# EAGLE design drive_board3 (EAGLE 6.1)
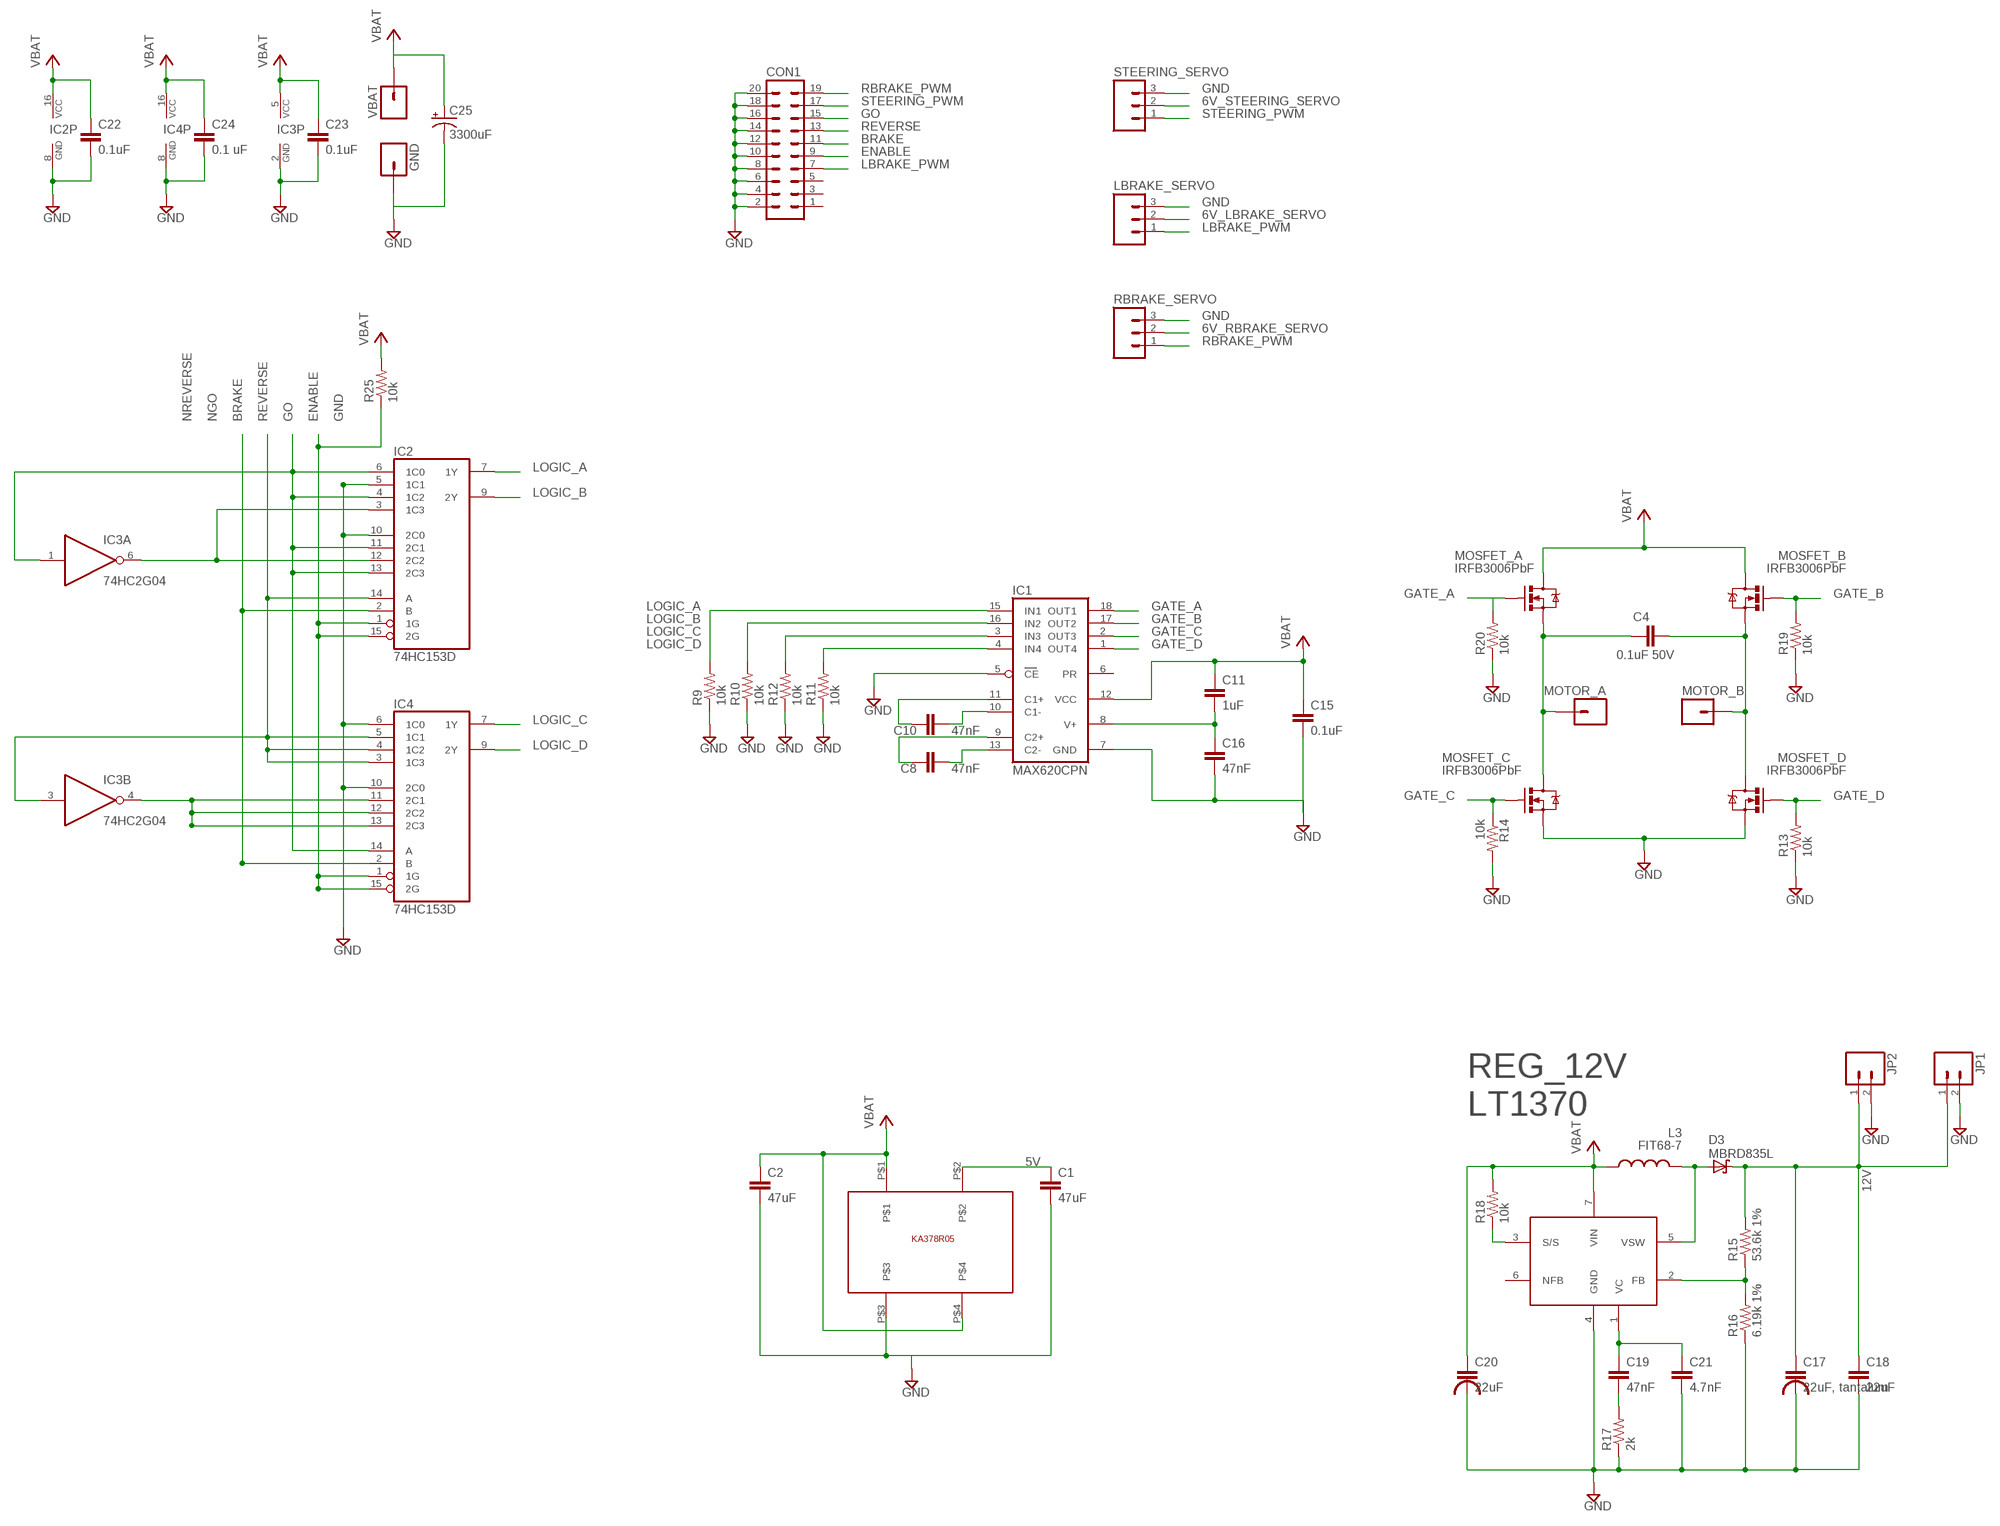
[diagram p0: schematic, sheet 1]

## Parts
C1  47uF  CAP0603-CAP  [0603-CAP]
C2  47uF  CAP0603-CAP  [0603-CAP]
C4  0.1uF 50V  CAP0603-CAP  [0603-CAP]
C8  47nF  CAP0603-CAP  [0603-CAP]
C10  47nF  CAP0603-CAP  [0603-CAP]
C11  1uF  CAP0603-CAP  [0603-CAP]
C15  0.1uF  CAP0603-CAP  [0603-CAP]
C16  47nF  CAP0603-CAP  [0603-CAP]
C17  22uF, tantalum  TPSD226M025R0200  [CAPACITOR_CASE_D]
C18  22uF  CAP0603-CAP  [0603-CAP]
C19  47nF  CAP0603-CAP  [0603-CAP]
C20  22uF  TPSD226M025R0200  [CAPACITOR_CASE_D]
C21  4.7nF  CAP0603-CAP  [0603-CAP]
C22  0.1uF  CAP0603-CAP  [0603-CAP]
C23  0.1uF  CAP0603-CAP  [0603-CAP]
C24  0.1 uF  CAP0603-CAP  [0603-CAP]
C25  3300uF  CAP_POLPTH1  [CPOL-RADIAL-100UF-25V]
CON1  ML20  [ML20]
D3  MBRD835L  [DPACK_1]
GND  GND  PAD_12GAPTH  [PAD_12GA]
IC1  MAX620CPN  [DIL18]
IC2  74HC153D  [SO16]
IC3  74HC2G04  [TSSOP6]
IC4  74HC153D  [SO16]
JP1  M025MM  [SCREWTERMINAL-5MM-2]
JP2  M025MM  [SCREWTERMINAL-5MM-2]
L3  FIT68-7  INDUCTOR  [TOROID_INDUCTOR]
LBRAKE_SERVO  M03POLAR  [MOLEX-1X3]
MOSFET_A  IRFB3006PbF  MOSFET-NCHANNELPTH2  [TO220V]
MOSFET_B  IRFB3006PbF  MOSFET-NCHANNELPTH2  [TO220V]
MOSFET_C  IRFB3006PbF  MOSFET-NCHANNELPTH2  [TO220V]
MOSFET_D  IRFB3006PbF  MOSFET-NCHANNELPTH2  [TO220V]
MOTOR_A  MOTOR A  PAD_12GAPTH  [PAD_12GA]
MOTOR_B  MOTOR B  PAD_12GAPTH  [PAD_12GA]
R9  10k  RESISTOR0603-RES  [0603-RES]
R10  10k  RESISTOR0603-RES  [0603-RES]
R11  10k  RESISTOR0603-RES  [0603-RES]
R12  10k  RESISTOR0603-RES  [0603-RES]
R13  10k  RESISTOR0603-RES  [0603-RES]
R14  10k  RESISTOR0603-RES  [0603-RES]
R15  53.6k 1%  RESISTOR0603-RES  [0603-RES]
R16  6.19k 1%  RESISTOR0603-RES  [0603-RES]
R17  2k  RESISTOR0603-RES  [0603-RES]
R18  10k  RESISTOR0603-RES  [0603-RES]
R19  10k  RESISTOR0603-RES  [0603-RES]
R20  10k  RESISTOR0603-RES  [0603-RES]
R25  10k  RESISTOR0603-RES  [0603-RES]
RBRAKE_SERVO  M03POLAR  [MOLEX-1X3]
REG_12V  LT1370  [TO220-7]
STEERING_SERVO  M03POLAR  [MOLEX-1X3]
U$5  KA378R05  [TO-220-4L]
VBAT  7.2V  PAD_12GAPTH  [PAD_12GA]

## Nets
6V_LBRAKE_SERVO: LBRAKE_SERVO.2
6V_RBRAKE_SERVO: RBRAKE_SERVO.2
6V_STEERING_SERVO: STEERING_SERVO.2
12V: C17.P$1 C18.1 D3.C JP1.1 JP2.1 R15.2
BRAKE: CON1.11 IC2.2(B) IC4.2(B)
ENABLE: CON1.9 IC2.1(1G) IC2.15(2G) IC4.1(1G) IC4.15(2G) R25.1
GATE_A: IC1.18(OUT1) MOSFET_A.1(G) R20.2
GATE_B: IC1.17(OUT2) MOSFET_B.1(G) R19.2
GATE_C: IC1.2(OUT3) MOSFET_C.1(G) R14.1
GATE_D: IC1.1(OUT4) MOSFET_D.1(G) R13.2
GND: C1.2 C2.2 C15.2 C16.2 C17.P$2 C18.2 C20.P$2 C21.2 C22.2 C23.2 C24.2 C25.2(-) CON1.2 CON1.4 CON1.6 CON1.8 CON1.10 CON1.12 CON1.14 CON1.16 CON1.18 CON1.20 GND.1 IC1.5(CE) IC1.7(GND) IC2.5(1C1) IC2.8(GND) IC2.10(2C0) IC3.2(P:GND) IC4.6(1C0) IC4.8(GND) IC4.10(2C0) JP1.2 JP2.2 LBRAKE_SERVO.3 MOSFET_C.3(S) MOSFET_D.3(S) R9.1 R10.1 R11.1 R12.1 R13.1 R14.2 R16.1 R17.1 R19.1 R20.1 RBRAKE_SERVO.3 REG_12V.4(GND) STEERING_SERVO.3 U$5.P$3
GO: CON1.15 IC2.4(1C2) IC2.6(1C0) IC2.11(2C1) IC2.13(2C3) IC3.1(A:I) IC4.14(A)
LBRAKE_PWM: CON1.7 LBRAKE_SERVO.1
LOGIC_A: IC1.15(IN1) IC2.7(1Y) R9.2
LOGIC_B: IC1.16(IN2) IC2.9(2Y) R10.2
LOGIC_C: IC1.3(IN3) IC4.7(1Y) R12.2
LOGIC_D: IC1.4(IN4) IC4.9(2Y) R11.2
MOTOR_A: C4.1 MOSFET_A.3(S) MOSFET_C.2(D) MOTOR_A.1
MOTOR_B: C4.2 MOSFET_B.3(S) MOSFET_D.2(D) MOTOR_B.1
N$1: C10.1 IC1.11(C1+)
N$2: C10.2 IC1.10(C1-)
N$3: C8.2 IC1.13(C2-)
N$4: C8.1 IC1.9(C2+)
N$6: C1.1 U$5.P$2
N$20: D3.B(A) D3.E(A) L3.2 REG_12V.5(VSW)
N$21: R15.1 R16.2 REG_12V.2(FB)
N$22: C19.1 C21.1 REG_12V.1(VC)
N$23: C19.2 R17.2
N$24: R18.1 REG_12V.3(S/S)
NGO: IC2.3(1C3) IC2.12(2C2) IC3.6(A:O)
NREVERSE: IC3.4(B:O) IC4.11(2C1) IC4.12(2C2) IC4.13(2C3)
RBRAKE_PWM: CON1.19 RBRAKE_SERVO.1
REVERSE: CON1.13 IC2.14(A) IC3.3(B:I) IC4.3(1C3) IC4.4(1C2) IC4.5(1C1)
STEERING_PWM: CON1.17 STEERING_SERVO.1
V+: C11.2 C16.1 IC1.8(V+)
VBAT: C11.1 C15.1 C20.P$1 C22.1 C23.1 C24.1 C25.1(+) IC1.12(VCC) IC2.16(VCC) IC3.5(P:VCC) IC4.16(VCC) L3.1 MOSFET_A.2(D) MOSFET_B.2(D) R18.2 REG_12V.7(VIN) VBAT.1
VCC: C2.1 R25.2 U$5.P$1 U$5.P$4 ; supply symbol labelled VBAT
Unconnected: CON1.1 CON1.3 CON1.5 IC1.6(PR) REG_12V.6(NFB)

## Notes on the sheet
- 5V

## Library data of the parts
C1 C2 C18 C22-C24 = SparkFun-Passives:CAP: Capacitor Standard 0603 ceramic capacitor, and 0.1" leaded capacitor.
C4 C8 C10 C11 C15 C16 C19 C21 = SparkFun:CAP: Capacitor Standard 0603 ceramic capacitor, and 0.1" leaded capacitor.
C17 C20 = group10:TPSD226M025R0200
C25 = SparkFun-Passives:CAP_POL: Capacitor Polarized These are standard SMD and PTH capacitors. Normally 10uF, 47uF, and 100uF in electrolytic and tantalum varieties. Always verify the external diameter of the through hole cap, it varies with capacity, voltage, and manufacturer. The EIA devices should be standard.
CON1 = con-harting-ml:ML20: HARTING; OC_FARNELL: unknown; OC_NEWARK: unknown
D3 = group10:MBRD835L
GND MOTOR_A MOTOR_B VBAT = group10:PAD_12GA: Header 1 Standard 1-pin 0.1" header. Use with straight break away headers (SKU : PRT-00116), right angle break away headers (PRT-00553), swiss pins (PRT-00743), machine pins (PRT-00117), and female headers (PRT-00115).
IC1 = maxim:MAX620CPN: MOSFET DRIVER; MPN: MAX620CPN+; OC_FARNELL: unknown; OC_NEWARK: 27M4142
IC2 IC4 = 74xx-eu:74*153: Dual 4-line to 1-line data SELECTOR/MULTIPLEXER
IC3 = group10:74HC2G04
JP1 JP2 = SparkFun-Connectors:M02: Header 2 Standard 2-pin 0.1" header. Use with straight break away headers (SKU : PRT-00116), right angle break away headers (PRT-00553), swiss pins (PRT-00743), machine pins (PRT-00117), and female headers (PRT-00115). Molex polarized connector foot print use with SKU : PRT-08233 with associated crimp pins and housings.
L3 = group10:INDUCTOR: Inductors Basic Inductor/Choke - 0603 and 1206. Footprints are not proven and vary greatly between part numbers.
LBRAKE_SERVO RBRAKE_SERVO STEERING_SERVO = SparkFun-Connectors:M03: Header 3 Standard 3-pin 0.1" header. Use with straight break away headers (SKU : PRT-00116), right angle break away headers (PRT-00553), swiss pins (PRT-00743), machine pins (PRT-00117), and female headers (PRT-00115). Molex polarized connector foot print use with SKU : PRT-08232 with associated crimp pins and housings.
MOSFET_A MOSFET_B MOSFET_C MOSFET_D = group10:MOSFET-NCHANNEL: Generic NMOS footprint
R9-R20 R25 = SparkFun:RESISTOR: Resistor Basic schematic elements and footprints for 0603, 1206, and PTH resistors.
REG_12V = group10:LT1370
U$5 = group10:KA378R05

## Board
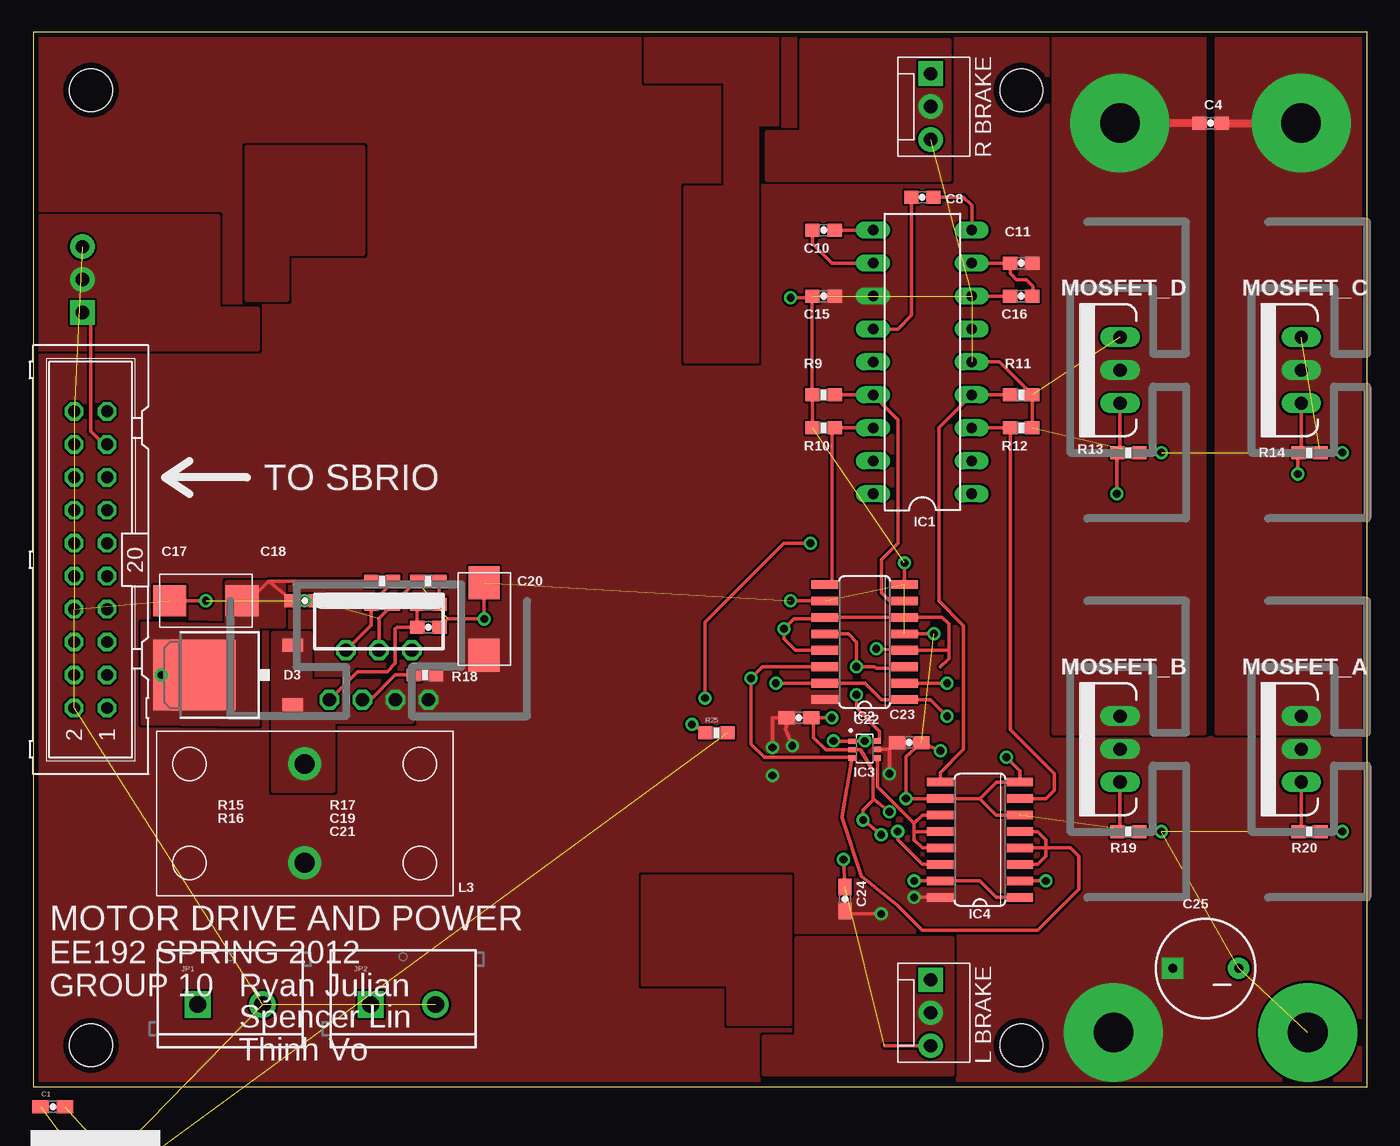
[diagram p1: board, top side]
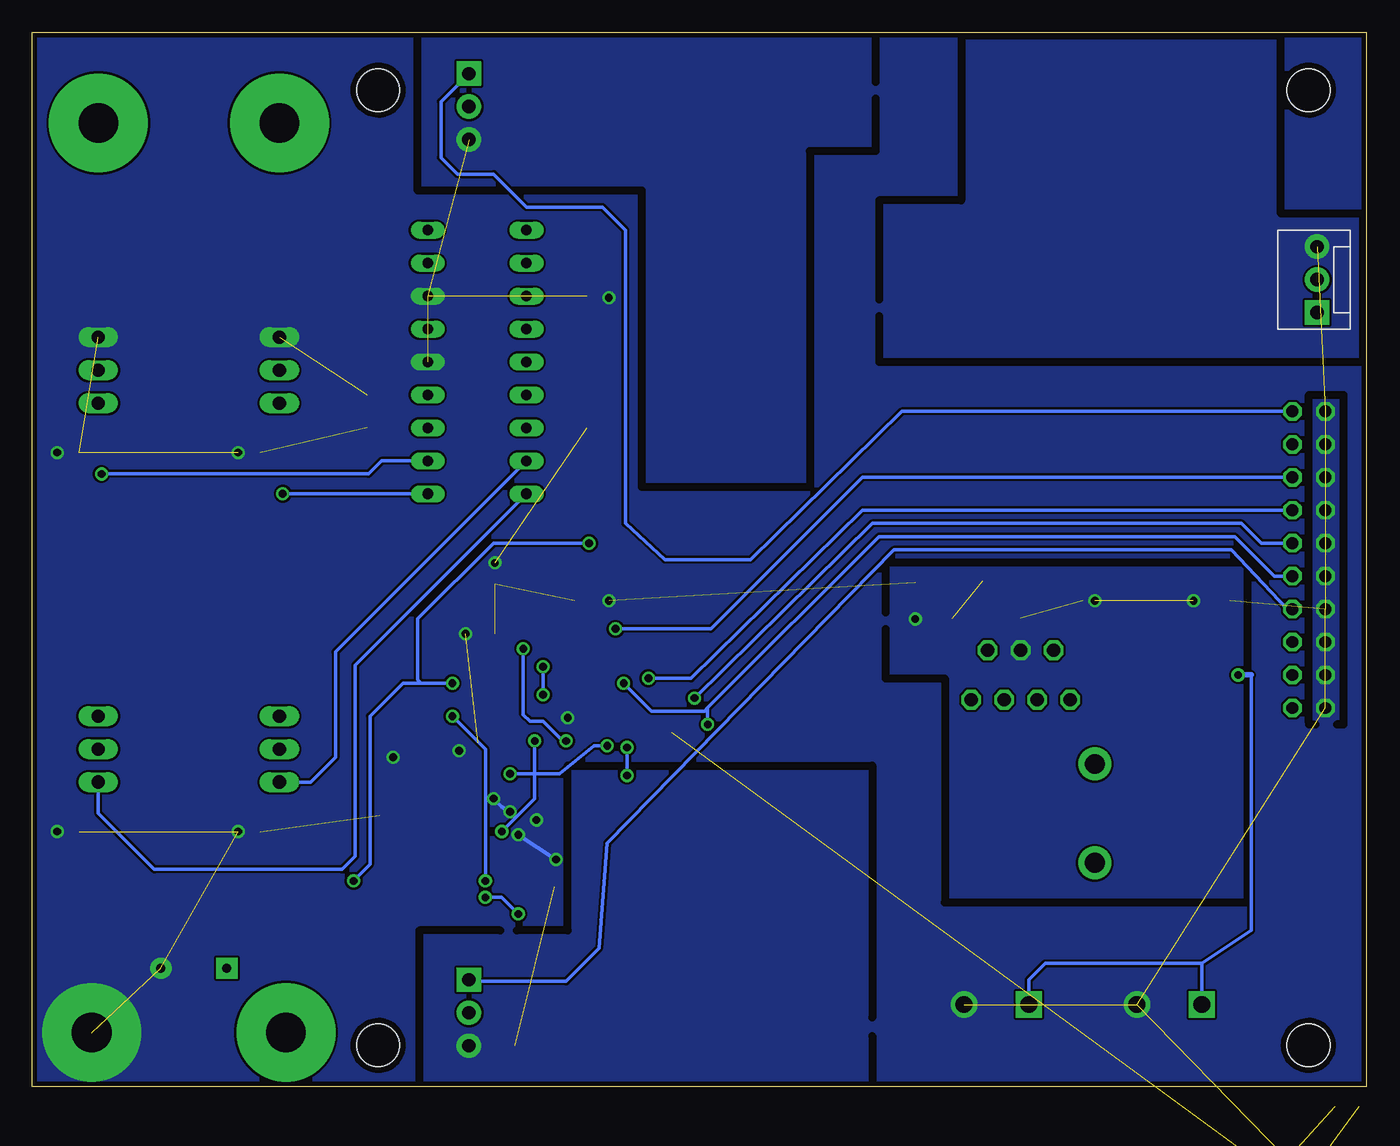
[diagram p2: board, bottom side, seen from below]

Size 102.87 x 81.28 mm. Coordinates in mm from the lower left corner, seen from the top.
Outline: 0,0 102.87,0 102.87,81.28 0,81.28 0,0
Copper layers (1*16): Top 0.035559375mm / dielectric 1.501140625mm / Bottom 0.035559375mm
Design rules: minimum track width 10mil, minimum drill 15mil, track to track 6mil, track to pad 6mil, pad to pad 6mil, via to via 6mil, smd to smd 6mil, copper to edge 15mil, drill to drill 8mil, minimum pad ring 10mil, minimum via ring 8mil, stop-mask expansion 4mil, vias tented up to drill 0mil, thermal gap 10mil
bRestrict: 36 lines

### Footprints (pad centres in the part's own frame; a part is rotated, then mirrored left to right if it is on the bottom)
0603-CAP = smd 1.27 x 1: 1 -0.934,0; 2 0.934,0
0603-CAP' = smd 1.1 x 1: 1 -0.85,0; 2 0.85,0
CAPACITOR_CASE_D = smd 2.54 x 2.388: P$1 -2.794,0; P$2 2.794,0
CPOL-RADIAL-100UF-25V = drill 0.7 pad 1.651 square: 1 2.54,0 | drill 0.7 pad 1.651: 2 -2.54,0
ML20 = drill 0.914 octagon: 1 -11.43,-1.27; 2 -11.43,1.27; 3 -8.89,-1.27; 4 -8.89,1.27; 5 -6.35,-1.27; 6 -6.35,1.27; 7 -3.81,-1.27; 8 -3.81,1.27; 9 -1.27,-1.27; 10 -1.27,1.27; 11 1.27,-1.27; 12 1.27,1.27; 13 3.81,-1.27; 14 3.81,1.27; 15 6.35,-1.27; 16 6.35,1.27; 17 8.89,-1.27; 18 8.89,1.27; 19 11.43,-1.27; 20 11.43,1.27
DPACK_1 = smd 1 x 1.6: B -2.28,-6.07; E 2.28,-6.07 | smd 5.4 x 6.35: C 0,1.524
PAD_12GA = drill 3.048 pad 7.62: 1 0,0
DIL18 = drill 0.813 long: 1 -10.16,-3.81; 2 -7.62,-3.81; 3 -5.08,-3.81; 4 -2.54,-3.81; 5 0,-3.81; 6 2.54,-3.81; 7 5.08,-3.81; 8 7.62,-3.81; 9 10.16,-3.81; 10 10.16,3.81; 11 7.62,3.81; 12 5.08,3.81; 13 2.54,3.81; 14 0,3.81; 15 -2.54,3.81; 16 -5.08,3.81; 17 -7.62,3.81; 18 -10.16,3.81
SO16 = smd 0.66 x 2.032: 1 -4.445,-3.073; 2 -3.175,-3.073; 3 -1.905,-3.073; 4 -0.635,-3.073; 5 0.635,-3.073; 6 1.905,-3.073; 7 3.175,-3.073; 8 4.445,-3.073; 9 4.445,3.073; 10 3.175,3.073; 11 1.905,3.073; 12 0.635,3.073; 13 -0.635,3.073; 14 -1.905,3.073; 15 -3.175,3.073; 16 -4.445,3.073
TSSOP6 = smd 0.55 x 0.4: 1 -0.99,0.61; 2 -0.99,-0.04; 3 -0.99,-0.69; 4 0.99,-0.69; 5 0.99,-0.015; 6 0.99,0.62
SCREWTERMINAL-5MM-2 = drill 1.3 pad 2.032 square: 1 0,0 | drill 1.3 pad 2.032: 2 5,0
TOROID_INDUCTOR = drill 1.524 pad 2.54: 1 0,3.81; 2 0,-3.81
MOLEX-1X3 = drill 1.016 pad 1.88 square: 1 0,0 | drill 1.016 pad 1.88: 2 2.54,0; 3 5.08,0
TO220V = drill 1.016 long: 1 -2.54,0; 2 0,0; 3 2.54,0
0603-RES = smd 1.1 x 1: 1 -0.85,0; 2 0.85,0
TO220-7 = drill 1.016 octagon: 1 -3.81,3.81; 2 0,2.54; 3 -3.81,1.27; 4 0,0; 5 -3.81,-1.27; 6 0,-2.54; 7 -3.81,-3.81
STAND-OFF = hole 3.302: 0,0
TO-220-4L = drill 1.25: P$1 -3.81,0; P$2 -1.27,0; P$3 1.27,0; P$4 3.81,0

### Placement (x,y rotation side)
C1  1.52,-1.52 0 top
C2  1.52,-11.43 0 top  (outside the outline)
C4  0.1uF 50V  [0603-CAP']  90.81,74.3 180 top
C8  47nF  [0603-CAP']  68.58,68.58 180 top
C10  47nF  [0603-CAP']  60.96,66.04 0 top
C11  1uF  [0603-CAP']  76.2,63.5 180 top
C15  0.1uF  [0603-CAP']  60.96,60.96 180 top
C16  47nF  [0603-CAP']  76.2,60.96 180 top
C17  13.34,37.47 180 top
C18  20.95,37.47 0 top
C19  47nF  [0603-CAP']  30.48,37.21 0 top
C20  34.8,36.07 90 top
C21  4.7nF  [0603-CAP']  30.48,35.43 0 top
C22  59.05,28.45 0 top
C23  67.56,26.54 0 top
C24  62.61,14.48 90 top
C25  90.42,9.14 180 top
CON1  4.45,40.64 90 top
D3  13.97,31.75 90 top
GND  98.3,4.19 0 top
IC1  68.58,55.88 90 top
IC2  64.14,34.29 90 top
IC3  64.14,26.04 0 top
IC4  73.03,19.05 90 top
JP1  12.7,6.35 0 top
JP2  26.04,6.35 0 top
L3  20.95,21.08 180 top
LBRAKE_SERVO  69.22,8.26 270 top
MOSFET_A  97.79,26.04 90 top
MOSFET_B  83.82,26.04 90 top
MOSFET_C  97.79,55.24 90 top
MOSFET_D  83.82,55.24 90 top
MOTOR_A  97.79,74.3 0 top
MOTOR_B  83.82,74.3 0 top
R9  60.96,53.34 0 top
R10  60.96,50.8 0 top
R11  76.2,53.34 180 top
R12  76.2,50.8 180 top
R13  84.45,48.9 180 top
R14  98.42,48.9 0 top
R15  26.92,38.99 180 top
R16  26.92,37.21 180 top
R17  30.48,38.99 0 top
R18  30.23,31.75 0 top
R19  84.45,19.68 180 top
R20  98.42,19.68 180 top
R25  52.7,27.3 0 top
RBRAKE_SERVO  69.22,78.11 270 top
REG_12V  26.67,33.66 90 top
STEERING_SERVO  3.81,59.69 90 bottom
U$1  [STAND-OFF]  4.47,76.83 0 top
U$2  [STAND-OFF]  76.2,76.83 0 top
U$3  [STAND-OFF]  4.47,3.2 0 top
U$4  [STAND-OFF]  76.2,3.2 0 top
U$5  4.83,-5.59 0 top  (outside the outline)
VBAT  83.31,4.19 0 top

### Tracks (layer width: path | path; a pad name or v marks a point on that pad's centre or on a via)
6V_LBRAKE_SERVO
  pour Top (isolate 0.178, no thermals): 56.39,3.81 58.93,3.81 58.93,11.43 70.87,11.43 70.87,1.02 56.39,1.02
6V_RBRAKE_SERVO
  pour Top (isolate 0.178, no thermals): 59.31,80.64 59.31,73.53 56.64,73.53 56.64,69.98 70.61,69.98 70.61,80.64
6V_STEERING_SERVO
  pour Top (isolate 0.178, no thermals): 17.27,58.67 17.27,59.94 14.22,59.94 14.22,67.06 0,67.06 0,56.9 17.27,56.9
12V  (via drill 0.6)
  Top 0.254: 26.16,38.99 R15.2 18.16,38.99 | 18.16,38.99 C18.1 | v9.91,31.75 12.7,31.75 | C17.P$1 16.64,37.47 18.16,38.99
  Bottom 0.254: 8.89,31.75 8.89,12.06 12.7,9.53 | JP1.1 12.7,9.53 | JP2.1 26.04,8.26 24.77,9.53 12.7,9.53
  Bottom 0.406: 8.89,31.75 v9.91,31.75
  pour Top (isolate 0.178, no thermals): 17.27,27.94 8.51,28.07 8.51,35.69 14.99,35.56 14.99,38.86 19.3,38.86 19.3,35.56 17.27,35.56
BRAKE  (via drill 0.6)
  Top 0.254: IC2.2 v70.48,31.11 | IC4.2 v78.11,15.88 | v51.82,29.97 51.82,35.81 57.91,41.91 v59.94,41.91
  Bottom 0.254: v70.48,31.11 72.9,31.11 | 72.9,31.11 74.3,31.11 76.83,28.57 76.83,17.14 v78.11,15.88 | CON1.11 8.13,41.91 9.65,43.43 38.1,43.43 v51.82,29.97 | v59.94,41.91 67.31,41.91 73.15,36.07 73.15,31.37 72.9,31.11
ENABLE  (via drill 0.6)
  Top 0.254: IC4.1 74.3,14.61 73.03,15.88 IC4.15 v67.94,15.88 | v70.48,28.57 69.22,29.84 IC2.1 65.41,29.84 64.14,31.11 IC2.15 v57.28,31.11 | R25.1 v50.8,27.94
  Bottom 0.254: v70.48,28.57 67.94,26.04 v67.94,15.88 | CON1.9 7.11,39.37 10.16,42.42 37.59,42.42 50.8,29.21 | 50.8,29.21 51.05,28.96 55.12,28.96 v57.28,31.11 | v50.8,27.94 50.8,29.21
GATE_A
  Top 0.254: MOSFET_A.1 97.79,19.68 R20.2
  Bottom 0.254: IC1.18 77.98,32.51 77.98,17.78 78.99,16.76 93.47,16.76 97.79,21.08 MOSFET_A.1
GATE_B
  Top 0.254: MOSFET_B.1 83.82,19.68 R19.2
  Bottom 0.254: IC1.17 79.5,33.53 79.5,25.4 81.41,23.5 MOSFET_B.1
GATE_C  (via drill 0.6)
  Top 0.254: MOSFET_C.1 97.79,48.9 R14.1 97.54,48.86 v97.54,47.24
  Bottom 0.254: IC1.2 75.95,48.26 76.96,47.24 v97.54,47.24
GATE_D  (via drill 0.6)
  Top 0.254: MOSFET_D.1 83.82,48.9 R13.2 83.57,48.9 | 83.19,48.9 83.57,48.9 | 83.57,48.9 v83.57,45.72
  Bottom 0.254: IC1.1 v83.57,45.72
GND  (via drill 0.6)  (36 unrouted)
  Top 0.254: R13.1 v87,48.9 | R14.2 v100.97,48.9 | R19.1 v87,19.68 | R20.1 v100.97,19.68 | IC2.10 v58.42,37.47 | IC2.8 v67.21,40.39 | IC2.5 v69.47,34.92 | C24.2 v62.48,17.53 | v69.98,25.91 C23.2 67.31,25.44 v67.31,22.23 IC4.10 73.03,22.23 | v75.06,25.4 76.1,24.36 IC4.8 74.3,23.5 73.03,22.23 | IC4.6 74.3,20.95 73.03,22.23 | 59.94,28.45 C22.2 59.69,28.45 | 59.94,28.45 v61.59,28.45 | 64.77,22.23 64.77,24.38 63.79,26 IC3.2 61.13,26 60.2,26.92 60.2,27.94 | 64.77,22.23 65.27,21.83 | 65.27,21.83 v66.04,21.21 | R10.1 60.11,53.3 60.07,53.34 | 60.07,53.34 60.07,60.83 | 60.07,60.83 v58.42,60.83 | 60.07,60.83 60.07,60.92 C15.2 | IC1.5 74.51,55.88 R11.1 R12.1 | IC1.7 C16.2 | C17.P$2 v13.34,37.47 | 65.66,3.17 LBRAKE_SERVO.3 | C20.P$2 v34.8,36.07 31.96,36.07 C21.2 | C18.2 v20.95,37.47 | REG_12V.4 26.67,36.11 R16.1 29.55,38.99 R17.1 | R9.1 60.07,53.34 | v65.41,19.43 v64.01,20.57 64.01,21.34 64.77,22.1 64.77,22.23 | 65.28,21.84 65.27,21.83 | 59.94,28.45 59.94,28.19 60.2,27.94 | 60.2,27.94 60.2,28.19 59.94,28.45
  Bottom 0.254: v67.31,22.23 66.67,21.59 v66.04,21.21 | v62.48,17.53 v65.41,19.43
  pour Bottom (isolate 0.178, rank 6, no thermals): 0,81.28 102.87,81.28 102.87,0 0,0
GO  (via drill 0.6)
  Top 0.254: v61.72,26.67 61.75,26.64 IC3.1 64.11,26.64 v64.14,26.67 | 69.98,32.38 70.61,33.02 70.61,33.78 | 70.61,33.78 70.61,35.69 70.1,36.2 IC2.6 IC2.11 60.96,36.09 60.96,36.07 58.67,36.07 v57.91,35.31 57.91,34.54 58.8,33.66 IC2.13 | 70.61,33.78 70.48,33.66 IC2.4 66.93,33.66 v65.02,33.78 | IC4.14 68.58,17.14 66.67,19.05 v66.67,19.68
  Bottom 0.254: v61.72,26.67 61.98,26.67 63.5,28.19 64.52,28.19 65.02,28.7 v65.02,33.78 | CON1.15 38.86,46.99 50.55,35.31 v57.91,35.31 58.04,35.31 | v66.67,19.68 64.14,22.23 v64.14,26.67
LBRAKE_PWM
  Bottom 0.254: CON1.7 6.1,36.83 10.41,41.4 36.45,41.4 58.55,18.8 59.18,10.67 61.72,8.13 69.09,8.13 LBRAKE_SERVO.1
LOGIC_A
  Top 0.254: R9.2 IC1.15 66.67,51.44 66.67,41.91 65.41,40.64 65.41,38.1 66.04,37.47 IC2.7
LOGIC_B
  Top 0.254: IC1.16 R10.2 61.59,50.8 61.59,38.73 IC2.9
LOGIC_C
  Top 0.254: IC1.3 R12.2 75.35,27.52 78.74,24.13 78.74,22.86 78.11,22.23 IC4.7
LOGIC_D
  Top 0.254: IC4.9 69.95,24.23 71.75,26.04 71.75,35.56 69.85,37.47 69.85,50.8 IC1.4 R11.2 75.56,53.34
MOTOR_A
  Top 0.61: C4.1 MOTOR_A.1
  pour Top (isolate 0.178, no thermals): 102.87,81.28 91.31,81.28 91.31,27.3 102.87,27.3
MOTOR_B
  Top 0.61: C4.2 83.95,74.3 83.82,74.42
  pour Top (isolate 0.178, no thermals): 90.3,81.28 78.74,81.28 78.74,27.3 90.3,27.3
N$1
  Top 0.254: C10.1 60.11,64.98 61.59,63.5 IC1.11
N$2
  Top 0.254: C10.2 IC1.10
N$3
  Top 0.254: C8.2 67.73,59.48 66.67,58.42 IC1.13
N$4
  Top 0.254: C8.1 71.75,68.58 72.39,67.94 IC1.9
N$5
  pour Top (isolate 0.178, no thermals): 19.56,60.71 16.51,60.71 16.51,72.39 25.4,72.39 25.4,64.26 19.56,64.26
N$6  (1 unrouted)
N$7
  pour Top (isolate 0.178, no thermals): 58.42,16.26 46.99,16.26 46.99,7.87 53.59,7.87 53.59,4.83 58.42,4.83
N$15
  pour Top (isolate 0.178, no thermals): 55.88,55.88 50.29,55.88 50.29,69.34 53.34,69.34 53.34,77.47 47.24,77.47 47.24,81.28 57.4,81.28 57.4,74.17 55.88,74.17
N$20
  pour Top (isolate 0.178, no thermals): 21.34,34.92 18.54,34.92 18.54,22.86 23.11,22.86 23.11,28.19 29.21,28.19 29.21,31.24 21.34,31.24
N$21
  Top 0.254: R15.1 R16.2 26.07,35.6 REG_12V.2
N$22
  Top 0.254: C19.1 C21.1 | C21.1 29.25,35.05 | REG_12V.1 25.02,32 27.3,32 27.94,32.64 27.94,35.31 28.07,35.43 C21.1
N$23
  Top 0.254: R17.2 C19.2
N$24
  Top 0.254: REG_12V.3 26.04,29.84 27.94,31.75 R18.1
NGO  (via drill 0.6)
  Top 0.254: IC2.12 62.87,34.92 63.5,34.29 v63.5,32.38 64.9,32.38 65.02,32.26 67.59,32.26 IC2.3 | v63.5,30.23 63.5,29.21 65.28,27.43 65.28,26.81 IC3.6
  Bottom 0.254: v63.5,32.38 v63.5,30.23
NREVERSE
  Top 0.254: IC4.11 68.58,20.95 67.94,20.32 | 67.94,20.32 67.94,19.68 | 67.94,19.68 67.94,19.05 68.58,18.41 IC4.13 | IC4.12 67.94,19.68 | IC3.4 65.12,23.14 67.94,20.32
RBRAKE_PWM
  Bottom 0.254: CON1.19 35.81,52.07 47.5,40.64 54.1,40.64 57.15,43.43 57.15,66.04 58.93,67.82 64.77,67.82 67.31,70.36 70.1,70.36 71.37,71.63 71.37,75.95 RBRAKE_SERVO.1
REVERSE  (via drill 0.6)
  Top 0.254: IC4.5 77.47,19.68 78.11,19.05 78.11,18.41 | 78.11,18.41 78.11,17.78 77.47,17.14 IC4.3 | IC4.4 78.11,18.41 | IC2.14 56.26,32.38 v55.37,31.5 55.37,26.42 56.39,25.4 63.09,25.4 IC3.3 62.38,20.8 63.88,16.26 66.67,13.97 68.58,12.06 77.47,12.06 80.64,15.24 80.64,17.78 80.01,18.41 78.11,18.41
  Bottom 0.254: CON1.13 38.86,44.45 52.07,31.5 v55.37,31.5
STEERING_PWM
  Top 0.254: STEERING_SERVO.1 4.45,59.05 4.45,50.55 5.46,49.53 CON1.17
V+
  Top 0.254: IC1.8 C11.2 75.35,62.7 75.82,62.23 76.58,62.23 77.09,61.72 77.09,61 C16.1
VBAT  (via drill 0.6)
  Top 0.254: v57.02,26.16 57.02,28.45 C22.1 58.25,28.32 58.04,27.56 v58.55,26.29 | C24.1 62.9,13.34 v65.41,13.34 | v67.94,14.61 IC4.16 | IC3.5 65.14,26.04 66.04,26.04 v66.04,24.13
  Bottom 0.254: v57.02,26.16 v57.02,24 | v65.41,13.34 66.67,14.61 v67.94,14.61 | v66.04,24.13 62.23,24.13 59.56,26.29 v58.55,26.29
  pour Top (isolate 0.178, rank 2, no thermals): 0,81.28 102.87,81.28 102.87,0 0,0
VCC  (3 unrouted)

### Text on the board
tNames: R BRAKE | TO SBRIO | MOTOR DRIVE AND POWER | EE192 SPRING 2012 | GROUP 10 | Ryan Julian | Spencer Lin | Thinh Vo | L BRAKE